# Altium schematic sheet 01_Power_IN.SchDoc
size A4
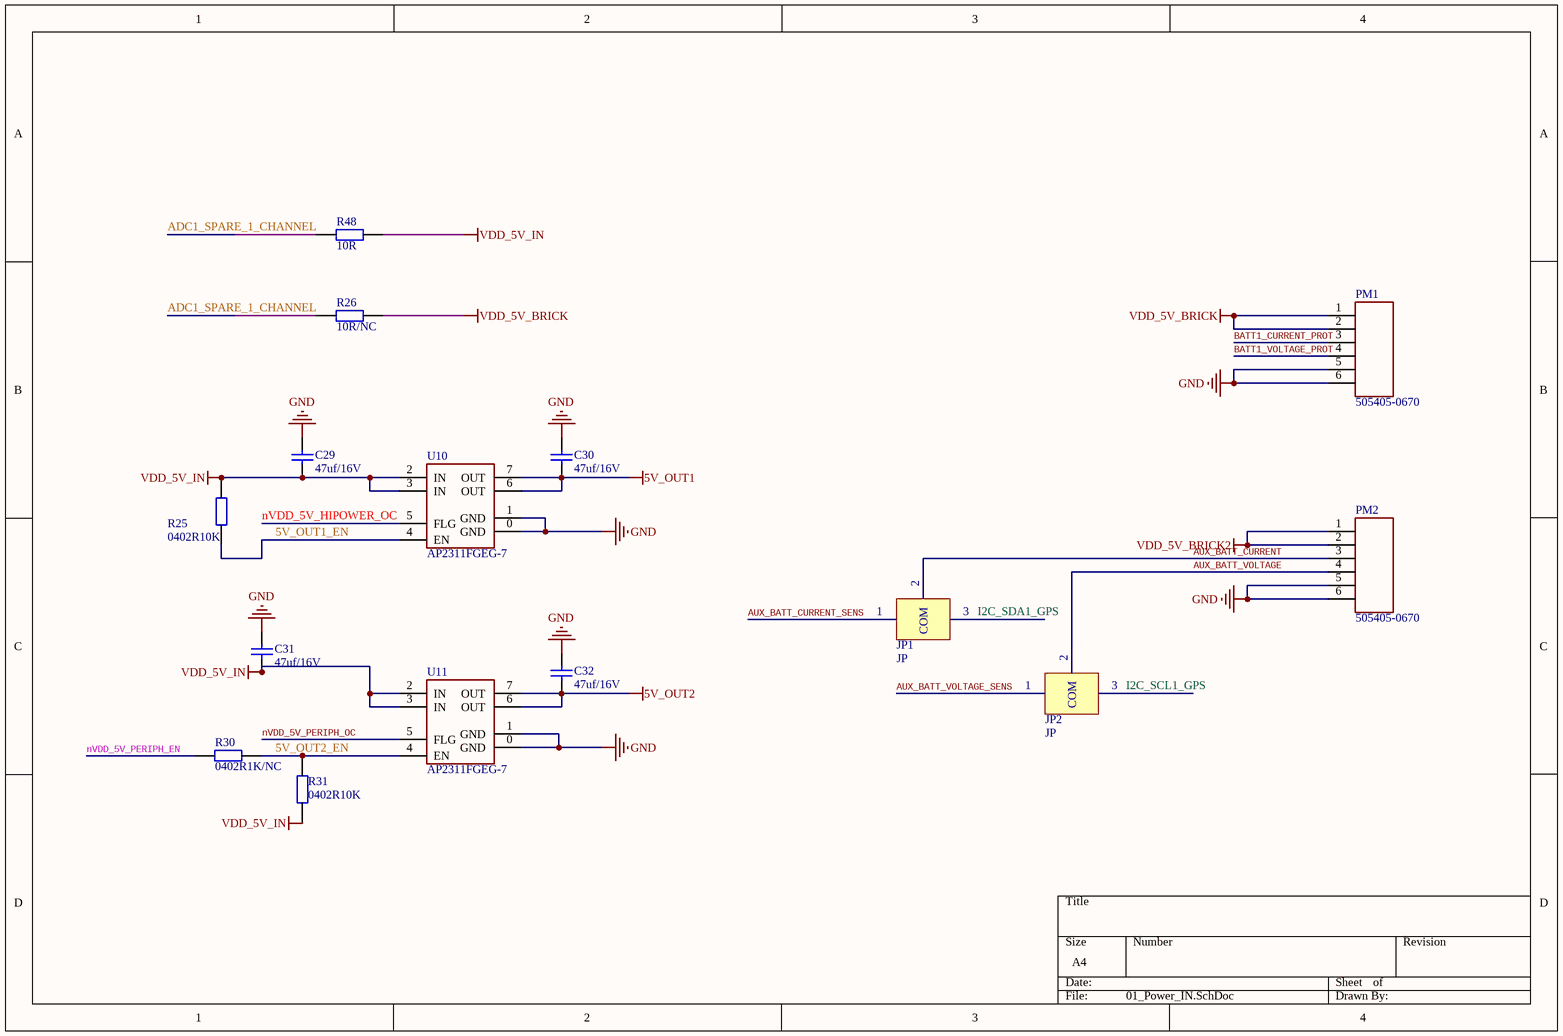
[diagram p0: 01_Power_IN.SchDoc]

## Parts
C29  47uf/16V  [0805CAP]
C30  47uf/16V  [0805CAP]
C31  47uf/16V  [0805CAP]
C32  47uf/16V  [0805CAP]
JP1  JP  [0402R-SR]
JP2  JP  [0402R-SR]
PM1  505405-0670  [5054050660]
PM2  505405-0670  [5054050660]
R25  0402R10K  [0402R]
R26  10R/NC  [0402R]
R30  0402R1K/NC  [0402R]
R31  0402R10K  [0402R]
R48  10R  [0402R]
U10  AP2311FGEG-7  [QFN8_0.65]
U11  AP2311FGEG-7  [QFN8_0.65]

## Nets
5V_OUT1: C30.1 U10.6(OUT) U10.7(OUT)
5V_OUT2: C32.1 U11.6(OUT) U11.7(OUT)
GND: C29.2 C30.2 C31.2 C32.2 PM1.5 PM1.6 PM2.5 PM2.6 U10.0(GND) U10.1(GND) U11.0(GND) U11.1(GND)
VDD_5V_BRICK: PM1.1 PM1.2 R26.2
VDD_5V_BRICK2: PM2.1 PM2.2
VDD_5V_IN: C29.1 C31.1 R25.2 R31.2 R48.2 U10.2(IN) U10.3(IN) U11.2(IN) U11.3(IN)
5V_OUT1_EN: R25.1 U10.4(EN)
5V_OUT2_EN: R30.1 R31.1 U11.4(EN)
ADC1_SPARE_1_CHANNEL: R26.1 R48.1
AUX_BATT_CURRENT: JP1.2(COM) PM2.3
AUX_BATT_CURRENT_SENS: JP1.1
AUX_BATT_VOLTAGE: JP2.2(COM) PM2.4
AUX_BATT_VOLTAGE_SENS: JP2.1
BATT1_CURRENT_PROT: PM1.3
BATT1_VOLTAGE_PROT: PM1.4
I2C_SCL1_GPS: JP2.3
I2C_SDA1_GPS: JP1.3
nVDD_5V_HIPOWER_OC: U10.5(FLG)
nVDD_5V_PERIPH_EN: R30.2
nVDD_5V_PERIPH_OC: U11.5(FLG)

## Library data of the parts
C29-C32 = Cap: Capacitor
JP1 JP2 = 0402R-SR
PM1 PM2 = 5054050660
R25 R26 R30 R31 R48 = 0402R1K: 0402R1K 1%